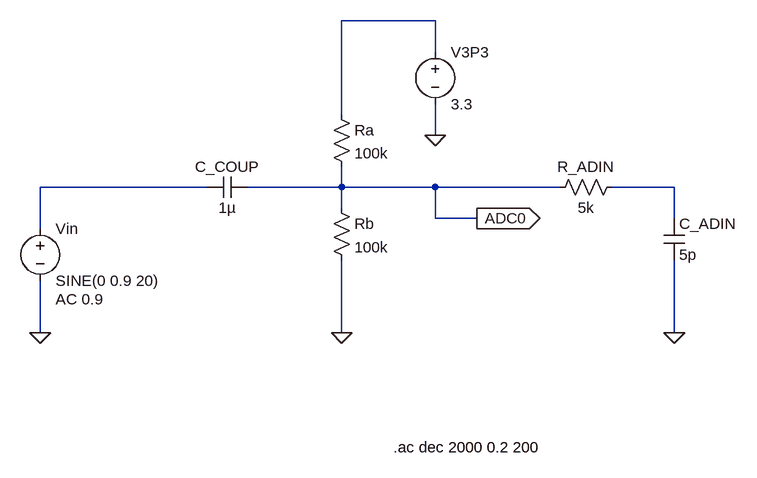
[diagram p0: schematic audiopassthrough.asc]
audiopassthrough.asc, the LTspice schematic file:
Version 4
SHEET 1 880 680
WIRE 304 -80 160 -80
WIRE 304 -32 304 -80
WIRE 160 64 160 -80
WIRE 304 96 304 48
WIRE -48 176 -304 176
WIRE 160 176 160 144
WIRE 160 176 16 176
WIRE 304 176 160 176
WIRE 496 176 304 176
WIRE 672 176 576 176
WIRE 160 208 160 176
WIRE 304 224 304 176
WIRE 368 224 304 224
WIRE 672 224 672 176
WIRE -304 240 -304 176
WIRE -304 400 -304 320
WIRE 160 400 160 288
WIRE 672 400 672 288
FLAG 160 400 0
FLAG 672 400 0
FLAG 304 96 0
FLAG -304 400 0
FLAG 368 224 ADC0
IOPIN 368 224 Out
SYMBOL res 144 48 R0
SYMATTR InstName Ra
SYMATTR Value 100k
SYMBOL res 144 192 R0
SYMATTR InstName Rb
SYMATTR Value 100k
SYMBOL res 592 160 R90
WINDOW 0 0 56 VBottom 2
WINDOW 3 32 56 VTop 2
SYMATTR InstName R_ADIN
SYMATTR Value 5k
SYMBOL cap 656 224 R0
SYMATTR InstName C_ADIN
SYMATTR Value 5p
SYMBOL cap 16 160 R90
WINDOW 0 0 32 VBottom 2
WINDOW 3 32 32 VTop 2
SYMATTR InstName C_COUP
SYMATTR Value 1µ
SYMBOL voltage 304 -48 R0
SYMATTR InstName V3P3
SYMATTR Value 3.3
SYMBOL voltage -304 224 R0
WINDOW 123 24 124 Left 2
WINDOW 39 0 0 Left 0
SYMATTR InstName Vin
SYMATTR Value SINE(0 0.9 20)
SYMATTR Value2 AC 0.9
TEXT 240 576 Left 2 !.ac dec 2000 0.2 200

The netlist it stands for:
* audiopassthrough.asc
Ra N001 ADC0 100k
Rb ADC0 0 100k
R_ADIN N003 ADC0 5k
C_ADIN N003 0 5p
C_COUP ADC0 N002 1µ
V3P3 N001 0 3.3
Vin N002 0 SINE(0 0.9 20) AC 0.9
.ac dec 2000 0.2 200
.backanno
.end